# EAGLE design darwin-lora (EAGLE 9.4.2)
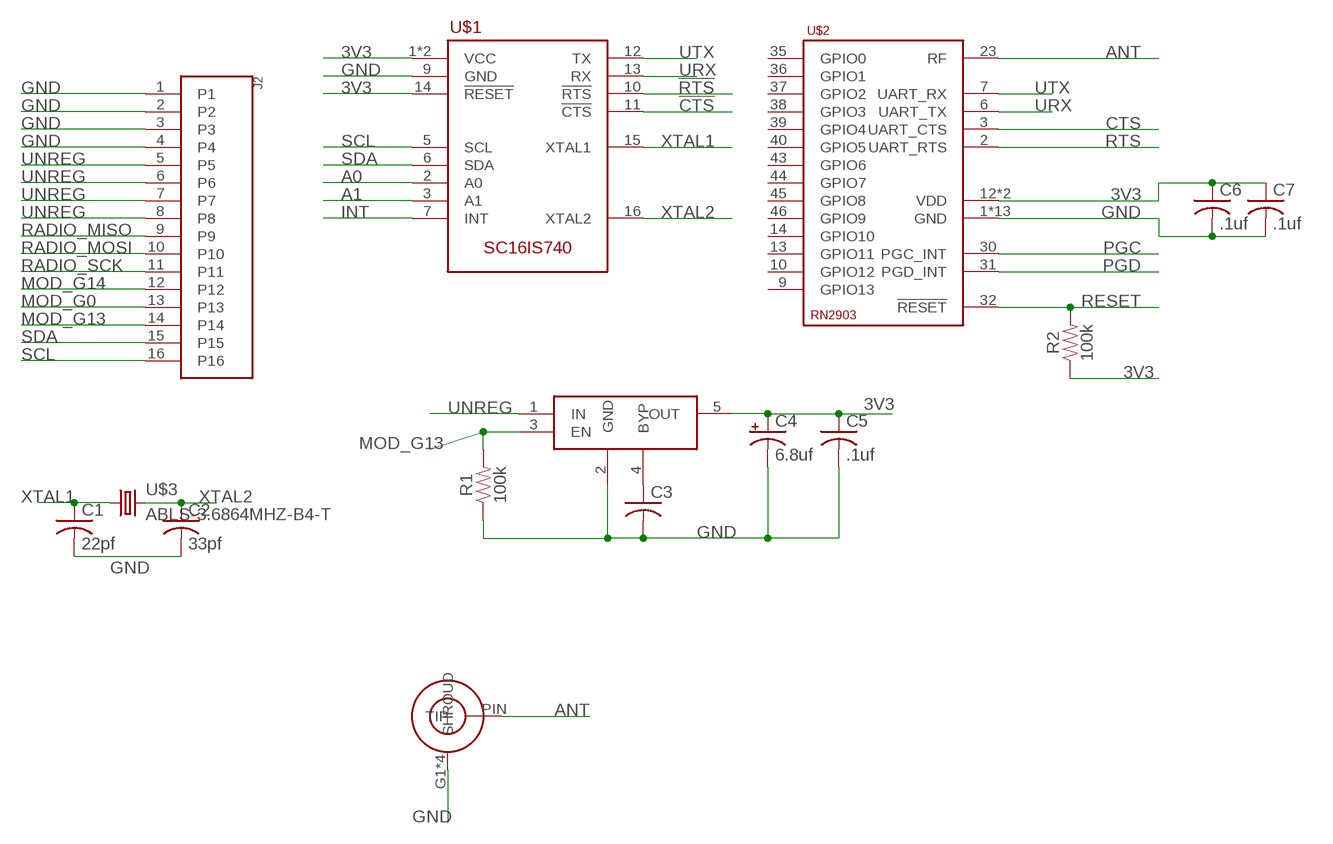
[diagram p0: schematic, sheet 1]

## Parts
C1  22pf  C-USC0603K  [C0603K]
C2  33pf  C-USC0603K  [C0603K]
C3  C-USC0603K  [C0603K]
C4  6.8uf  CPOL-USA/3216-18R  [A/3216-18R]
C5  .1uf  C-USC0603K  [C0603K]
C6  .1uf  C-USC0603K  [C0603K]
C7  .1uf  C-USC0603K  [C0603K]
J2  505110-1692  [505110-1692]
R1  100k  100KOHM-0603-1/10W-1%  [0603]
R2  100k  100KOHM-0603-1/10W-1%  [0603]
U$1  SC16IS740  [SOP65P640X110-16]
U$2  RN2903  [RN2903]
U$3  ABLS-3.6864MHZ-B4-T  [ABLS]
U$4  MIC5219-3.3YM5-TR  [SOT95P280X145-5]
U$5  5-1814832-1  [5-1814832-1]

## Nets
3V3: C4.+ C5.1 C6.1 C7.1 R2.1 U$1.1(VCC) U$1.8(VCC) U$1.14(!RESET) U$2.12(VDD) U$2.34(VDD) U$4.5(OUT)
!CTS: U$1.11(!CTS)
!RTS: U$1.10(!RTS)
A0: U$1.2(A0)
A1: U$1.3(A1)
ANT: U$2.23(RF) U$5.PIN(TIP)
CTS: U$2.3(UART_CTS)
GND: C1.2 C2.2 C3.2 C4.- C5.2 C6.2 C7.2 J2.1 J2.2 J2.3 J2.4 R1.1 U$1.9(GND) U$2.1(GND) U$2.8(GND) U$2.11(GND) U$2.20(GND) U$2.21(GND) U$2.22(GND) U$2.24(GND) U$2.26(GND) U$2.27(GND) U$2.28(GND) U$2.33(GND) U$2.41(GND) U$2.47(GND) U$4.2(GND) U$5.G1(SHROUD) U$5.G2(SHROUD) U$5.G3(SHROUD) U$5.G4(SHROUD)
INT: U$1.7(INT)
MOD_G0: J2.13
MOD_G13: J2.14 R1.2 U$4.3(EN)
MOD_G14: J2.12
N$6: C3.1 U$4.4(BYP)
PGC: U$2.30(PGC_INT)
PGD: U$2.31(PGD_INT)
RADIO_MISO: J2.9
RADIO_MOSI: J2.10
RADIO_SCK: J2.11
RESET: R2.2 U$2.32(!RESET)
RTS: U$2.2(UART_RTS)
SCL: J2.16 U$1.5(SCL)
SDA: J2.15 U$1.6(SDA)
UNREG: J2.5 J2.6 J2.7 J2.8 U$4.1(IN)
URX: U$1.13(RX) U$2.6(UART_TX)
UTX: U$1.12(TX) U$2.7(UART_RX)
XTAL1: C1.1 U$1.15(XTAL1) U$3.P$1
XTAL2: C2.1 U$1.16(XTAL2) U$3.P$2
Unconnected: U$2.9(GPIO13) U$2.10(GPIO12) U$2.13(GPIO11) U$2.14(GPIO10) U$2.35(GPIO0) U$2.36(GPIO1) U$2.37(GPIO2) U$2.38(GPIO3) U$2.39(GPIO4) U$2.40(GPIO5) U$2.43(GPIO6) U$2.44(GPIO7) U$2.45(GPIO8) U$2.46(GPIO9)

## Library data of the parts
C1-C3 C5-C7 = rcl:C-US: CAPACITOR, American symbol; SPICEPREFIX: C
C4 = rcl:CPOL-US: POLARIZED CAPACITOR, American symbol; SPICEPREFIX: C
J2 = Conservify:505110-1692
R1 R2 = SparkFun-Resistors:100KOHM: 100kΩ resistor A resistor is a passive two-terminal electrical component that implements electrical resistance as a circuit element. Resistors act to reduce current flow, and, at the same time, act to lower voltage levels within circuits. - Wikipedia; PROD_ID: RES-07828
U$1 = Conservify:SC16IS740
U$2 = Conservify:RN2903
U$3 = Conservify:ABLS-3.6864MHZ-B4-T
U$4 = Conservify:MIC5219-3.3YM5-TR
U$5 = Conservify:5-1814832-1

## Board
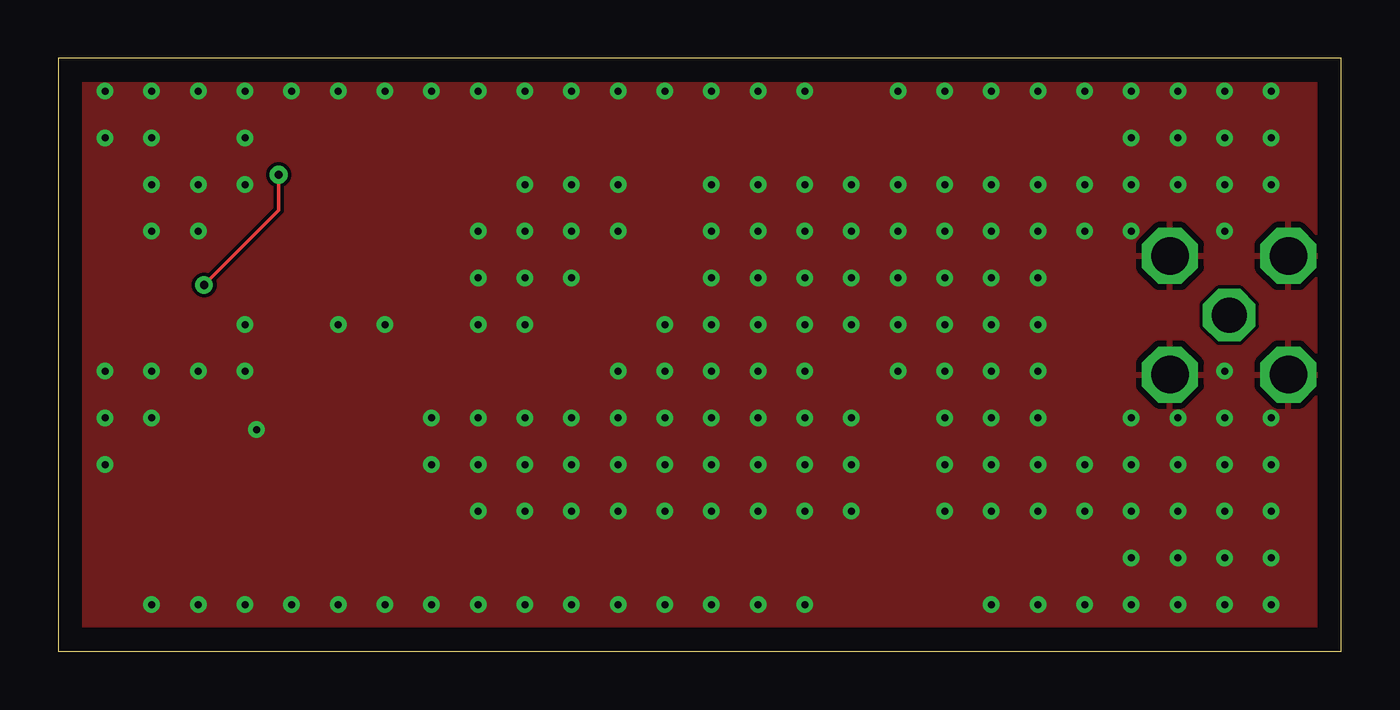
[diagram p1: board, top side]
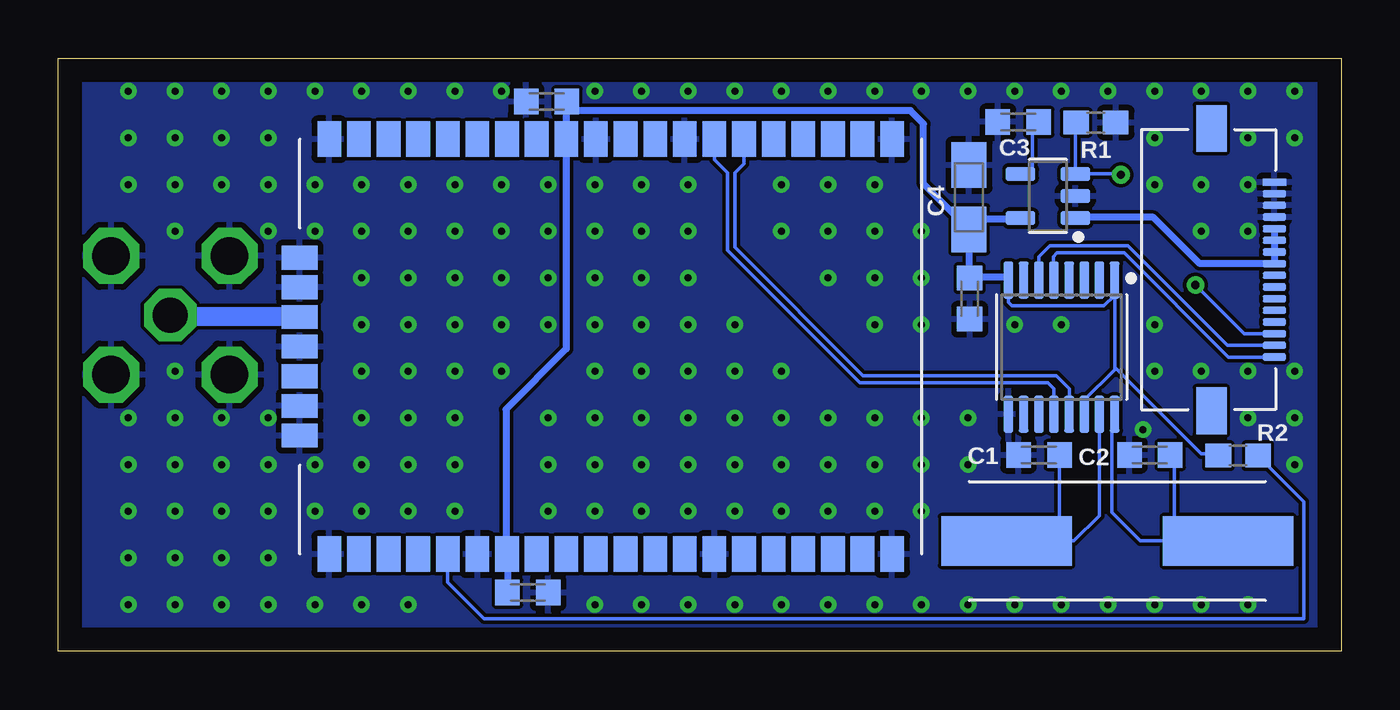
[diagram p2: board, bottom side, seen from below]

Size 55 x 25.41 mm. Coordinates in mm from the lower left corner, seen from the top.
Outline: 0,0 55,0 55,25.41 0,25.41 0,0
Copper layers (1*16): Top 0.035mm / dielectric 1.5mm / Bottom 0.035mm
Design rules "default *": minimum track width 6mil, minimum drill 0.3mm, track to track 6mil, track to pad 6mil, pad to pad 6mil, via to via 6mil, smd to smd 6mil, copper to edge 40mil, drill to drill 20mil, minimum pad ring 10mil, minimum via ring 8mil, stop-mask expansion 4mil, vias tented up to drill 0.3mm, thermal gap 10mil

### Footprints (pad centres in the part's own frame; a part is rotated, then mirrored left to right if it is on the bottom)
C0603K = smd 1.05 x 1.08: 1 -0.875,0; 2 0.875,0
A/3216-18R = smd 1.95 x 1.5: + 1.375,0; - -1.375,0
505110-1692 = smd 0.3 x 1: 1 -3.75,2.7; 2 -3.25,2.7; 3 -2.75,2.7; 4 -2.25,2.7; 5 -1.75,2.7; 6 -1.25,2.7; 7 -0.75,2.7; 8 -0.25,2.7; 9 0.25,2.7; 10 0.75,2.7; 11 1.25,2.7; 12 1.75,2.7; 13 2.25,2.7; 14 2.75,2.7; 15 3.25,2.7; 16 3.75,2.7 | smd 2 x 1.3: PAD1 -6.05,0; PAD2 6.05,0
0603 = smd 1.1 x 1: 1 -0.85,0; 2 0.85,0
SOP65P640X110-16 = smd 1.572 x 0.407: 1 -2.872,2.275; 2 -2.872,1.625; 3 -2.872,0.975; 4 -2.872,0.325; 5 -2.872,-0.325; 6 -2.872,-0.975; 7 -2.872,-1.625; 8 -2.872,-2.275; 9 2.872,-2.275; 10 2.872,-1.625; 11 2.872,-0.975; 12 2.872,-0.325; 13 2.872,0.325; 14 2.872,0.975; 15 2.872,1.625; 16 2.872,2.275
RN2903 = smd 1.524 x 1.016: 1 17.78,1.27; 2 17.78,2.54; 3 17.78,3.81; 4 17.78,5.08; 5 17.78,6.35; 6 17.78,7.62; 7 17.78,8.89; 8 17.78,10.16; 9 17.78,11.43; 10 17.78,12.7; 11 17.78,13.97; 12 17.78,15.24; 13 17.78,16.51; 14 17.78,17.78; 15 17.78,19.05; 16 17.78,20.32; 17 17.78,21.59; 18 17.78,22.86; 19 17.78,24.13; 20 17.78,25.4; 28 0,25.4; 29 0,24.13; 30 0,22.86; 31 0,21.59; 32 0,20.32; 33 0,19.05; 34 0,17.78; 35 0,16.51; 36 0,15.24; 37 0,13.97; 38 0,12.7; 39 0,11.43; 40 0,10.16; 41 0,8.89; 42 0,7.62; 43 0,6.35; 44 0,5.08; 45 0,3.81; 46 0,2.54; 47 0,1.27 | smd 1.016 x 1.524: 21 12.7,26.67; 22 11.43,26.67; 23 10.16,26.67; 24 8.89,26.67; 25 7.62,26.67; 26 6.35,26.67; 27 5.08,26.67
ABLS = smd 5.588 x 2.108: P$1 -4.75,0; P$2 4.75,0
SOT95P280X145-5 = smd 1.262 x 0.609: 1 -1.175,0.95; 2 -1.175,0; 3 -1.175,-0.95; 4 1.175,-0.95; 5 1.175,0.95
5-1814832-1 = drill 1.6 octagon: G1 -2.54,2.54; G2 -2.54,-2.54; G3 2.54,-2.54; G4 2.54,2.54 | drill 1.5 octagon: PIN 0,0

### Placement (x,y rotation side)
C1  12.95,8.41 180 bottom
C2  8.2,8.41 180 bottom
C3  13.84,22.68 180 bottom
C4  15.95,19.46 270 bottom
C5  15.93,15.11 270 bottom
C6  34.07,23.56 180 bottom
C7  34.87,2.51 0 bottom
J2  5.56,16.36 270 bottom
R1  10.52,22.66 180 bottom
R2  4.42,8.38 0 bottom
U$1  11.99,13.03 270 bottom
U$2  17.98,4.17 90 bottom
U$3  9.6,4.72 0 bottom
U$4  12.57,19.51 180 bottom
U$5  50.2,14.4 0 top

### Tracks (layer width: path | path; a pad name or v marks a point on that pad's centre or on a via)
3V3
  Bottom 0.152: R2.1 5.36,8.47 6,8.47 9.71,12.18 | 9.71,12.18 9.71,15.27 | 9.71,15.27 U$1.1 | 9.71,12.18 9.71,12.07 11.05,10.74 11.05,10.19 U$1.14 | C6.1 33.22,23.53 | U$1.8 14.26,14.95 14.12,14.81 10.17,14.81 9.71,15.27
  Bottom 0.305: U$4.5 13.77,18.54 15.49,18.54 C4.+ | C4.+ 15.95,16.01 C5.1 15.88,16.04 14.4,16.04 U$1.8 | C4.+ 17.91,20.04 17.91,22.61 18.47,23.16 32.75,23.16 33.14,23.56 C6.1 | 33.22,23.53 U$2.12 33.22,12.95 35.81,10.36 35.81,4.22 U$2.34 35.75,4.15 C7.1
ANT
  Bottom 0.813: U$2.23 50.2,14.33 U$5.PIN
GND  (via drill 0.3)
  other vias: 20,6 22,6 24,6 26,6 28,6 30,6 32,6 34,6 38,6 40,6 42,6 44,6 46,6 20,8 20,10 22,10 24,10 24,12 26,12 26,14 28,14 28,16 28,18 28,20 24,20 22,20 20,20 18,18 4,18 6,18 6,20 4,20 8,20 24,18 22,18 22,16 20,18 18,16 20,16 20,14 18,14 14,14 12,14 4,22 2,22 2,10 4,10 6,12 8,12 8,14 18,10 16,10 16,8 18,8 22,8 24,8 26,8 26,10 28,10 28,12 28,8 30,20 32,20 32,18 32,16 32,14 32,12 34,10 34,8 32,10 32,8 30,8 30,10 30,12 30,14 30,16 30,18 38,8 38,10 38,12 36,12 36,14 34,14 34,16 34,18 34,20 36,20 36,18 36,16 38,16 38,14 38,18 38,20 40,20 40,18 40,16 40,14 40,12 40,10 40,8 42,8 42,10 42,12 42,14 42,16 42,18 42,20 40,2 42,2 44,2 46,2 44,8 46,8 44,18 46,18 44,20 46,20 46,22 44,24 42,24 40,24 38,24 36,24 32,24 30,24 28,24 26,24 24,24 22,24 20,24 18,24 16,24 14,24 12,24 10,24 8,24 8,22 6,24 4,24 2,24 2,12 4,12 46,24 48,24 50,24 52,24 52,22 50,22 48,22 48,20 50,20 52,20 50,18 46,10 48,10 50,10 52,10 52,8 50,8 50,12 48,8 46,4 48,2 50,2 52,2 52,4 52,6 50,6 50,4 48,4 48,6 8.5,9.5 32,2 30,2 28,2 26,2 24,2 22,2 20,2 18,2 18,6 16,2 14,2 12,2 10,2 8,2 6,2 4,2 2,8
  pour Bottom: 0,0 55,0 55,26 0,26
  pour Top: 0,0 55,0 55,26 0,26
MOD_G13  (via drill 0.35)
  Top 0.152: v6.25,15.7 9.45,18.9 v9.45,20.42
  Bottom 0.152: R1.2 11.4,22.62 U$4.3 9.48,20.46 v9.45,20.42 | J2.14 4.16,13.61 v6.25,15.7
N$6
  Bottom 0.152: U$4.4 13.25,20.46 13.25,22.4 C3.1
RESET
  Bottom 0.152: R2.2 1.6,6.41 1.6,1.4 36.75,1.4 38.3,2.95 U$2.32
SCL
  Bottom 0.152: J2.16 4.83,12.61 9.3,17.07 12.19,17.07 12.34,16.92 12.34,15.93 U$1.5
SDA
  Bottom 0.152: J2.15 4.88,13.11 9.14,17.37 12.49,17.37 12.96,16.9 U$1.6
UNREG
  Bottom 0.305: U$4.1 11.36,18.59 8.05,18.59 6.07,16.61 J2.8 J2.7 J2.6 J2.5
URX
  Bottom 0.152: U$1.13 11.66,11.25 12.22,11.8 20.5,11.8 26,17.3 26,20.5 25.6,20.9 U$2.6
UTX
  Bottom 0.152: U$1.12 12.31,11.25 12.56,11.5 20.63,11.5 26.3,17.18 26.3,20.5 26.87,21.07 U$2.7
XTAL1
  Bottom 0.152: U$1.15 10.36,5.82 11.46,4.72 12.04,4.72 | 12.04,4.72 U$3.P$1 | C1.1 12.08,4.76 12.04,4.72
XTAL2
  Bottom 0.152: U$1.16 9.84,10.03 9.84,5.96 8.61,4.72 7.16,4.72 | 7.16,4.72 U$3.P$2 | C2.1 7.16,8.24 7.16,4.72